# Altium project PCB_Project.PrjPcb
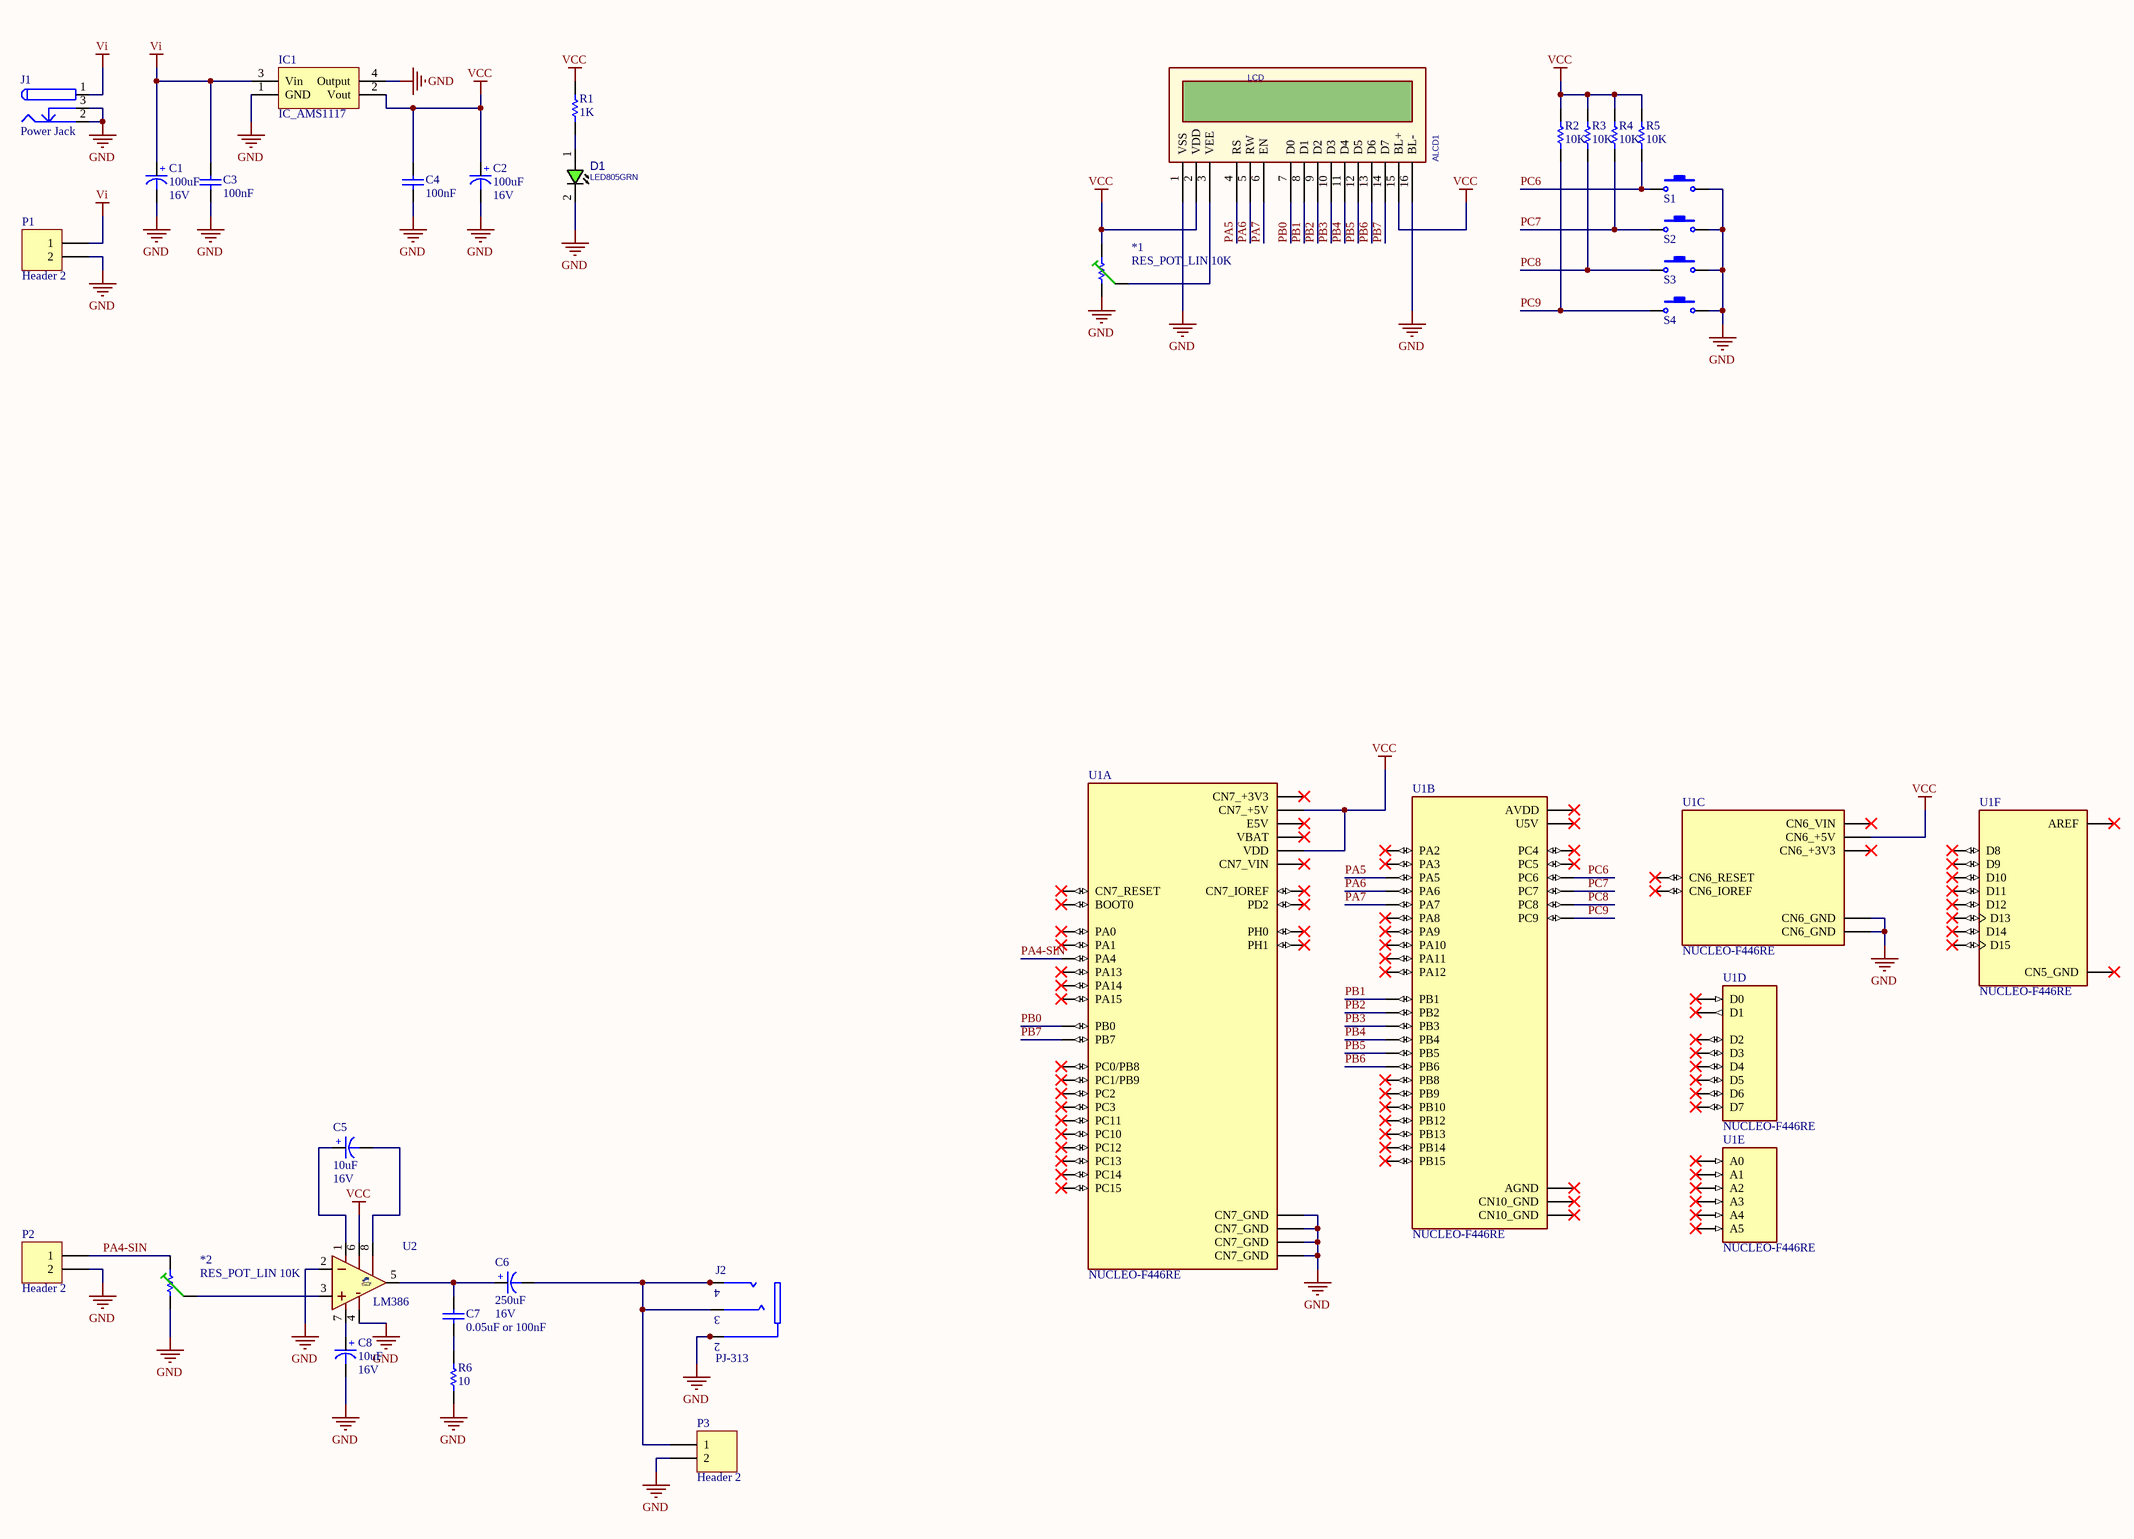
[diagram p0: Sheet2.SchDoc]
1 sheet, 30 parts. Net scope: global (net labels, ports and power ports of the same name join across sheets).
Board file: PCB3.PcbDoc

## Sheet Sheet2.SchDoc
size A2; SheetNumber: 1; SheetTotal: 1; SPICEModelCacheELAHDFLP: <root> / <DocumentId>ELAHDFLP</DocumentId> / </root>

### Parts
*1  RES_POT_LIN 10K  [3296W]
*2  RES_POT_LIN 10K  [3296W]
ALCD1  LCD  [LCD_2X16 GREEN10mm]
C1  Voltage: 16V  [cap 01]  (hidden comment: 100uF)
C2  Voltage: 16V  [cap 01]  (hidden comment: 100uF)
C3  100nF  [CAPC3413X12N]
C4  100nF  [CAPC3413X12N]
C5  Voltage: 16V  [cap 01]  (hidden comment: 10uF)
C6  Voltage: 16V  [cap 01]  (hidden comment: 250uF)
C7  0.05uF or 100nF  [CAPC3413X12N]
C8  Voltage: 16V  [cap 01]  (hidden comment: 10uF)
D1  LED805GRN  [LED0805GRN]
IC1  IC_AMS1117  [SOT223-4N]
J1  Power Jack  [Power Jack]
J2  PJ-313  [PJ-313]
P1  Header 2  [HDR1X2]
P2  Header 2  [HDR1X2]
P3  Header 2  [CON_MKDSN1,5/2-5,08]
R1  1K  [RESC3413X04N]
R2  10K  [RESC3413X04N]
R3  10K  [RESC3413X04N]
R4  10K  [RESC3413X04N]
R5  10K  [RESC3413X04N]
R6  10  [RESC3413X04N]
S1  Switch PB  [SWPBT_SPST_6X6X10]  (value not drawn)
S2  Switch PB  [SWPBT_SPST_6X6X10]  (value not drawn)
S3  Switch PB  [SWPBT_SPST_6X6X10]  (value not drawn)
S4  Switch PB  [SWPBT_SPST_6X6X10]  (value not drawn)
U1  NUCLEO-F446RE  [MODULE_NUCLEO-F446RE]  (parts A,B,C,D,E,F of 6)
U2  LM386  [DIP8]

### Nets
GND: *1.3(CW) *2.3(CW) ALCD1.1(VSS) ALCD1.16(BL-) C1.2(-) C2.2(-) C3.1 C4.1 C8.2(-) D1.2(CATHODE) IC1.1(GND) IC1.4(Output) J1.2 J1.3 J2.2_1 J2.2_2 P1.2 P2.2 P3.2 R6.1 S1.2 S2.2 S3.2 S4.2 U1.CN6_6(CN6_GND) U1.CN6_7(CN6_GND) U1.CN7_8(CN7_GND) U1.CN7_19(CN7_GND) U1.CN7_20(CN7_GND) U1.CN7_22(CN7_GND) U2.2(IN-) U2.4(GND)
VCC: *1.1(CCW) ALCD1.2(VDD) ALCD1.15(BL+) C2.1(+) C4.2 IC1.2(Vout) R1.1 R2.2 R3.2 R4.2 R5.2 U1.CN6_5(CN6_+5V) U1.CN7_5(VDD) U1.CN7_18(CN7_+5V) U2.6(VS)
Vi: C1.1(+) C3.2 IC1.3(Vin) J1.1 P1.1
PA4-SIN: *2.1(CCW) P2.1 U1.CN7_32(PA4)
PA5: ALCD1.4(RS) U1.CN10_11(PA5)
PA6: ALCD1.5(RW) U1.CN10_13(PA6)
PA7: ALCD1.6(EN) U1.CN10_15(PA7)
PB0: ALCD1.7(D0) U1.CN7_34(PB0)
PB1: ALCD1.8(D1) U1.CN10_24(PB1)
PB2: ALCD1.9(D2) U1.CN10_22(PB2)
PB3: ALCD1.10(D3) U1.CN10_31(PB3)
PB4: ALCD1.11(D4) U1.CN10_27(PB4)
PB5: ALCD1.12(D5) U1.CN10_29(PB5)
PB6: ALCD1.13(D6) U1.CN10_17(PB6)
PB7: ALCD1.14(D7) U1.CN7_21(PB7)
PC6: R5.1 S1.1 U1.CN10_4(PC6)
PC7: R4.1 S2.1 U1.CN10_19(PC7)
PC8: R3.1 S3.1 U1.CN10_2(PC8)
PC9: R2.1 S4.1 U1.CN10_1(PC9)
Net*1_2: *1.2(WIPER) ALCD1.3(VEE)
Net*2_2: *2.2(WIPER) U2.3(IN+)
NetC5_1: C5.1(+) U2.1(GAIN)
NetC5_2: C5.2(-) U2.8(GAIN)
NetC6_1: C6.1(+) C7.2 U2.5(VOUT)
NetC6_2: C6.2(-) J2.3 J2.4_1 J2.4_2 P3.1
NetC7_1: C7.1 R6.2
NetC8_1: C8.1(+) U2.7(BYPASS)
NetD1_1: D1.1(ANODE) R1.2

Not connected (* = marked no-connect by the designer): U1 CN5_1(D8)* CN5_2(D9)* CN5_3(D10)* CN5_4(D11)* CN5_5(D12)* CN5_6(D13)* CN5_7(CN5_GND)* CN5_8(AREF)* CN5_9(D14)* CN5_10(D15)* CN6_2(CN6_IOREF)* CN6_3(CN6_RESET)* CN6_4(CN6_+3V3)* CN6_8(CN6_VIN)* CN7_1(PC10)* CN7_2(PC11)* CN7_3(PC12)* CN7_4(PD2)* CN7_6(E5V)* CN7_7(BOOT0)* CN7_12(CN7_IOREF)* CN7_13(PA13)* CN7_14(CN7_RESET)* CN7_15(PA14)* CN7_16(CN7_+3V3)* CN7_17(PA15)* CN7_23(PC13)* CN7_24(CN7_VIN)* CN7_25(PC14)* CN7_27(PC15)* CN7_28(PA0)* CN7_29(PH0)* CN7_30(PA1)* CN7_31(PH1)* CN7_33(VBAT)* CN7_35(PC2)* CN7_36(PC1/PB9)* CN7_37(PC3)* CN7_38(PC0/PB8)* CN8_1(A0)* CN8_2(A1)* CN8_3(A2)* CN8_4(A3)* CN8_5(A4)* CN8_6(A5)* CN9_1(D0)* CN9_2(D1)* CN9_3(D2)* CN9_4(D3)* CN9_5(D4)* CN9_6(D5)* CN9_7(D6)* CN9_8(D7)* CN10_3(PB8)* CN10_5(PB9)* CN10_6(PC5)* CN10_7(AVDD)* CN10_8(U5V)* CN10_9(CN10_GND)* CN10_12(PA12)* CN10_14(PA11)* CN10_16(PB12)* CN10_20(CN10_GND)* CN10_21(PA9)* CN10_23(PA8)* CN10_25(PB10)* CN10_26(PB15)* CN10_28(PB14)* CN10_30(PB13)* CN10_32(AGND)* CN10_33(PA10)* CN10_34(PC4)* CN10_35(PA2)* CN10_37(PA3)*

### Library data of the parts
*1 *2 = RES_POT_LIN
ALCD1 = LCD: Alphanumic LCD; Designer: Abbas Basereh; Data: 16-12-2016
C1 C2 C5 C6 C8 = Cap-Polar: Polar Capacitor; Designer: Saeid Jorablo; Organazation: ControTec; Adding Date: 1387/12/20
  C1 C2: Value: 100uF
  C5 C8: Value: 10uF
  C6: Value: 250uF
C3 C4 C7 = CAP SMD 0805: CAP 0805; Designer: Abbas Basereh; Desc.: CAP SMD 0805; Data: 16-12-2016
D1 = LED_SMD_0805_GRN: LED, SMD, 0805, GREEN; PARAM: 20mA; DESC: DESCRIPTION; PARAM2: 2.2V; MANF: -; ASSEMBLY: ASSEMBLY; PRICE: 36t@Javan; MANF_P#: -; VALUE: LED805GRN
IC1 = IC_AMS1117: 800mA LOW DROPOUT VOLTAGE REGULATOR; Manufacturer: Advanced Monolithic Systems, Inc.; Company: SJ Libraries; Designer: Eng. Saeid Jorablo; ESD Sensetive: True/False; Code_IPC: SOT-223; ComponentLink1Description: Datasheet; ComponentLink1URL: http://www.advanced-monolithic.com/pdf/ds1117.pdf; ComponentLink2Description: Reference; ComponentLink2URL: http://www.advanced-monolithic.com/index.html; PackageDescription: SOT223, 4-Leads, Body 6.7x7.3mm (max), Pitch 2.30mm; PinCount: 4; Update: 6/5/2012; Category: Integrated Circuit; Status: Unrelease; HelpURL: http://s3.picofile.com/file/7443264187/Coming_Soon_logo.gif; Operating Temperature: -55 ~ +125 (C); Mounting Technology: Surface Mount; RoHS compliant: True/False
J1 = Power Jack: Designer: Saeid Jorablo; Company: Personal; Project Name: Laser; Adding Date: 10/21/2009
J2 = PJ-313: DC DC Converter Output Input; MF: ADC Telecommunications; MP: PJ313; Value: *; Availability: Unavailable; Price: None; Package: None; SnapEDA_Link: https://www.snapeda.com/parts/PJ313/ADC%20Telecommunications/view-part/423792/?ref=snap
P1-P3 = Header 2: Header, 2-Pin; LatestRevisionDate: 17-Jul-2002; LatestRevisionNote: Re-released for DXP Platform.; Publisher: Altium Limited
R1-R6 = RES 0805 0.125W: RES 0805; Designer: Abbas Basereh; Desc.: RES SMD 0805; Data: 16-12-2016
S1-S4 = Switch PB: Push Button Switch
U1 = NUCLEO-F446RE: STM32 Nucleo-64 development board with STM32F446RET6 MCU, supports Arduino and ST morpho connectivity; Price: None; MP: NUCLEO-F446RE; Value: *; Availability: Unavailable; Package: None
U2 = LM386_DIP8: AMP, Audio, Low Voltage, Power Amp; MANF: Texas Instruments; MANF_P#: LM386N-1; VALUE: LM386